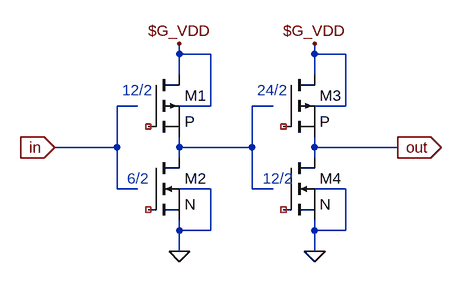
[diagram p0: schematic buf.asc]
buf.asc, the LTspice schematic file:
Version 4
SHEET 1 1292 836
WIRE -624 -80 -624 -96
WIRE -576 -80 -624 -80
WIRE -416 -80 -416 -96
WIRE -368 -80 -416 -80
WIRE -624 -48 -624 -80
WIRE -416 -48 -416 -80
WIRE -688 0 -720 0
WIRE -576 0 -576 -80
WIRE -576 0 -624 0
WIRE -480 0 -512 0
WIRE -368 0 -368 -80
WIRE -368 0 -416 0
WIRE -720 64 -720 0
WIRE -720 64 -816 64
WIRE -624 64 -624 48
WIRE -512 64 -512 0
WIRE -512 64 -624 64
WIRE -416 64 -416 48
WIRE -288 64 -416 64
WIRE -624 80 -624 64
WIRE -416 80 -416 64
WIRE -720 128 -720 64
WIRE -688 128 -720 128
WIRE -576 128 -624 128
WIRE -512 128 -512 64
WIRE -480 128 -512 128
WIRE -368 128 -416 128
WIRE -624 192 -624 176
WIRE -576 192 -576 128
WIRE -576 192 -624 192
WIRE -416 192 -416 176
WIRE -368 192 -368 128
WIRE -368 192 -416 192
WIRE -624 224 -624 192
WIRE -416 224 -416 192
FLAG -624 224 0
FLAG -816 64 in
IOPIN -816 64 In
FLAG -288 64 out
IOPIN -288 64 Out
FLAG -624 -96 $G_VDD
FLAG -416 224 0
FLAG -416 -96 $G_VDD
SYMBOL pmos -672 -48 R0
SYMATTR InstName M1
SYMATTR Value2 L=0.6U W=7.2U AS=4.86P AD=13.005P PS=7.2U PD=20.7U
SYMATTR SpiceModel ""
SYMATTR Value P
SYMBOL nmos -672 80 R0
SYMATTR InstName M2
SYMATTR Value2 L=0.6U W=3.6U AS=4.86P AD=7.065P PS=7.2U PD=13.5U
SYMATTR Value N
SYMBOL pmos -464 -48 R0
SYMATTR InstName M3
SYMATTR Value2 l=0.6U w=7.2U ad=13.005P as=4.86P pd=20.7U ps=7.2U m=2
SYMATTR SpiceModel ""
SYMATTR Value P
SYMBOL nmos -464 80 R0
SYMATTR InstName M4
SYMATTR Value2 l=0.6U w=3.6U ad=7.065P as=4.86P pd=13.5U ps=7.2U m=2
SYMATTR Value N
TEXT -712 -24 Left 2 ;12/2
TEXT -704 112 Left 2 ;6/2
TEXT -504 -24 Left 2 ;24/2
TEXT -496 112 Left 2 ;12/2

The netlist it stands for:
* buf.asc
* M1: P L=0.6U W=7.2U AS=4.86P AD=13.005P PS=7.2U PD=20.7U (symbol pmos not certain, pin order unknown); nets seen at it: $G_VDD, N001
* M2: N L=0.6U W=3.6U AS=4.86P AD=7.065P PS=7.2U PD=13.5U (symbol nmos not certain, pin order unknown); nets seen at it: 0, N001
* M3: P l=0.6U w=7.2U ad=13.005P as=4.86P pd=20.7U ps=7.2U m=2 (symbol pmos not certain, pin order unknown); nets seen at it: $G_VDD, out
* M4: N l=0.6U w=3.6U ad=7.065P as=4.86P pd=13.5U ps=7.2U m=2 (symbol nmos not certain, pin order unknown); nets seen at it: 0, out
* 12/2
* 6/2
* 24/2
* 12/2
.backanno
.end